# EAGLE design pads (EAGLE 9.4.2)
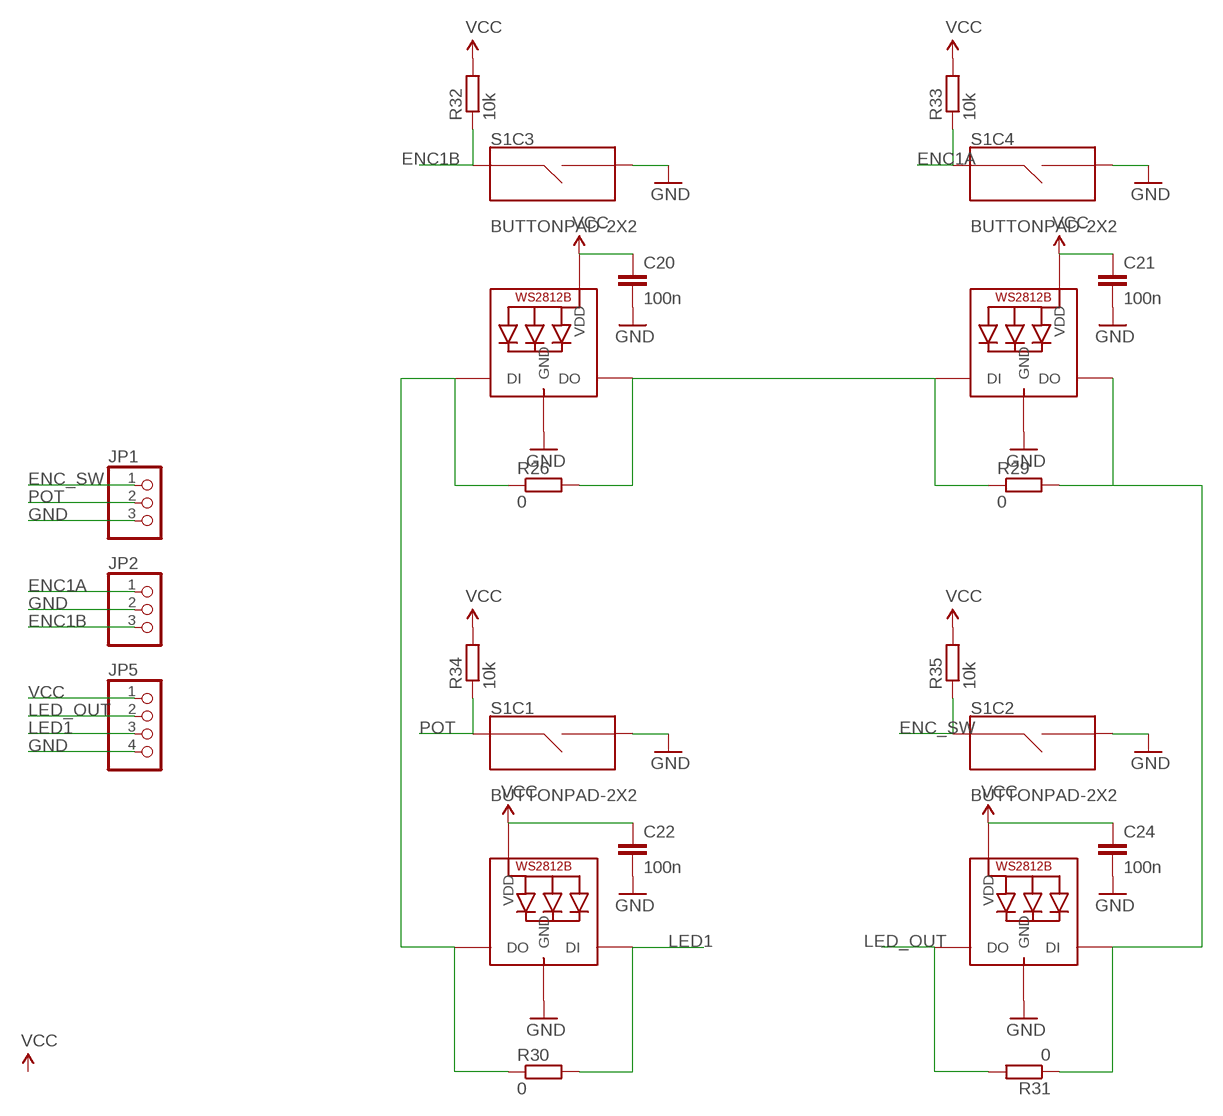
[diagram p0: schematic, sheet 1]

## Parts
C20  100n  CAP0603-CAP  [0603-CAP]
C21  100n  CAP0603-CAP  [0603-CAP]
C22  100n  CAP0603-CAP  [0603-CAP]
C24  100n  CAP0603-CAP  [0603-CAP]
JP1  PINHD-1X31X03_SMT  [1X03_SMT]
JP2  PINHD-1X31X03_SMT  [1X03_SMT]
JP5  PINHD-1X41X04_SMT  [1X04_SMT]
LED16  WS2812B3535  [LED3535]
LED17  WS2812B3535  [LED3535]
LED18  WS2812B3535  [LED3535]
LED19  WS2812B3535  [LED3535]
R26  0  R-EU_R0603  [R0603]
R29  0  R-EU_R0603  [R0603]
R30  0  R-EU_R0603  [R0603]
R31  0  R-EU_R0603  [R0603]
R32  10k  R-EU_R0603  [R0603]
R33  10k  R-EU_R0603  [R0603]
R34  10k  R-EU_R0603  [R0603]
R35  10k  R-EU_R0603  [R0603]
S1  BUTTONPAD-2X2  [BUTTONPAD-2X2-SINGLE]

## Nets
ENC1A: JP2.1 R33.1 S1.SIG7(C4:SIG1)
ENC1B: JP2.3 R32.1 S1.SIG5(C3:SIG1)
ENC_SW: JP1.1 R35.1 S1.SIG3(C2:SIG1)
GND: C20.2 C21.2 C22.2 C24.2 JP1.3 JP2.2 JP5.4 LED16.4(GND) LED17.4(GND) LED18.4(GND) LED19.4(GND) S1.SIG2(C1:SIG2) S1.SIG4(C2:SIG2) S1.SIG6(C3:SIG2) S1.SIG8(C4:SIG2)
LED1: JP5.3 LED16.1(DI) R30.2
LED_OUT: JP5.2 LED17.3(DO) R31.2
N$13: LED16.3(DO) LED18.1(DI) R26.1 R30.1
N$43: LED17.1(DI) LED19.3(DO) R29.2 R31.1
N$44: LED18.3(DO) LED19.1(DI) R26.2 R29.1
POT: JP1.2 R34.1 S1.SIG1(C1:SIG1)
VCC: C20.1 C21.1 C22.1 C24.1 JP5.1 LED16.2(VDD) LED17.2(VDD) LED18.2(VDD) LED19.2(VDD) R32.2 R33.2 R34.2 R35.2

## Library data of the parts
C20-C22 C24 = SparkFun-Capacitors:CAP: Capacitor Standard 0603 ceramic capacitor, and 0.1" leaded capacitor.
JP1 JP2 = pinhead_plus:PINHD-1X3: PIN HEADER
JP5 = pinhead_plus:PINHD-1X4: PIN HEADER
LED16-LED19 = i2c_encoder:WS2812B
R26 R29-R35 = rcl:R-EU_: RESISTOR, European symbol
S1 = i2c_encoder:BUTTONPAD-2X2: 2x2 Button Pad w/ Single LEDs Layout and schematic for 2x2 button pad with single-color LEDs under each button. For use with the Button Pad 2x2 - LED Compatible <https://www.sparkfun.com/products/7836> and Button Pad 2x2 Top Bezel <https://www.sparkfun.com/products/8746>. Any single-color 5mm LED <https://www.sparkfun.com/categories/172> should be compatible. SparkFun Products SparkFun Simon Says - Through-Hole Soldering Kit <https://www.sparkfun.com/products/10547> (KIT-10547) Button Pad 2x2 - Breakout PCB <https://www.sparkfun.com/products/9277> (COM-09277); PROD_ID: COMP-08481; SF_SKU: COM-07836

## Board
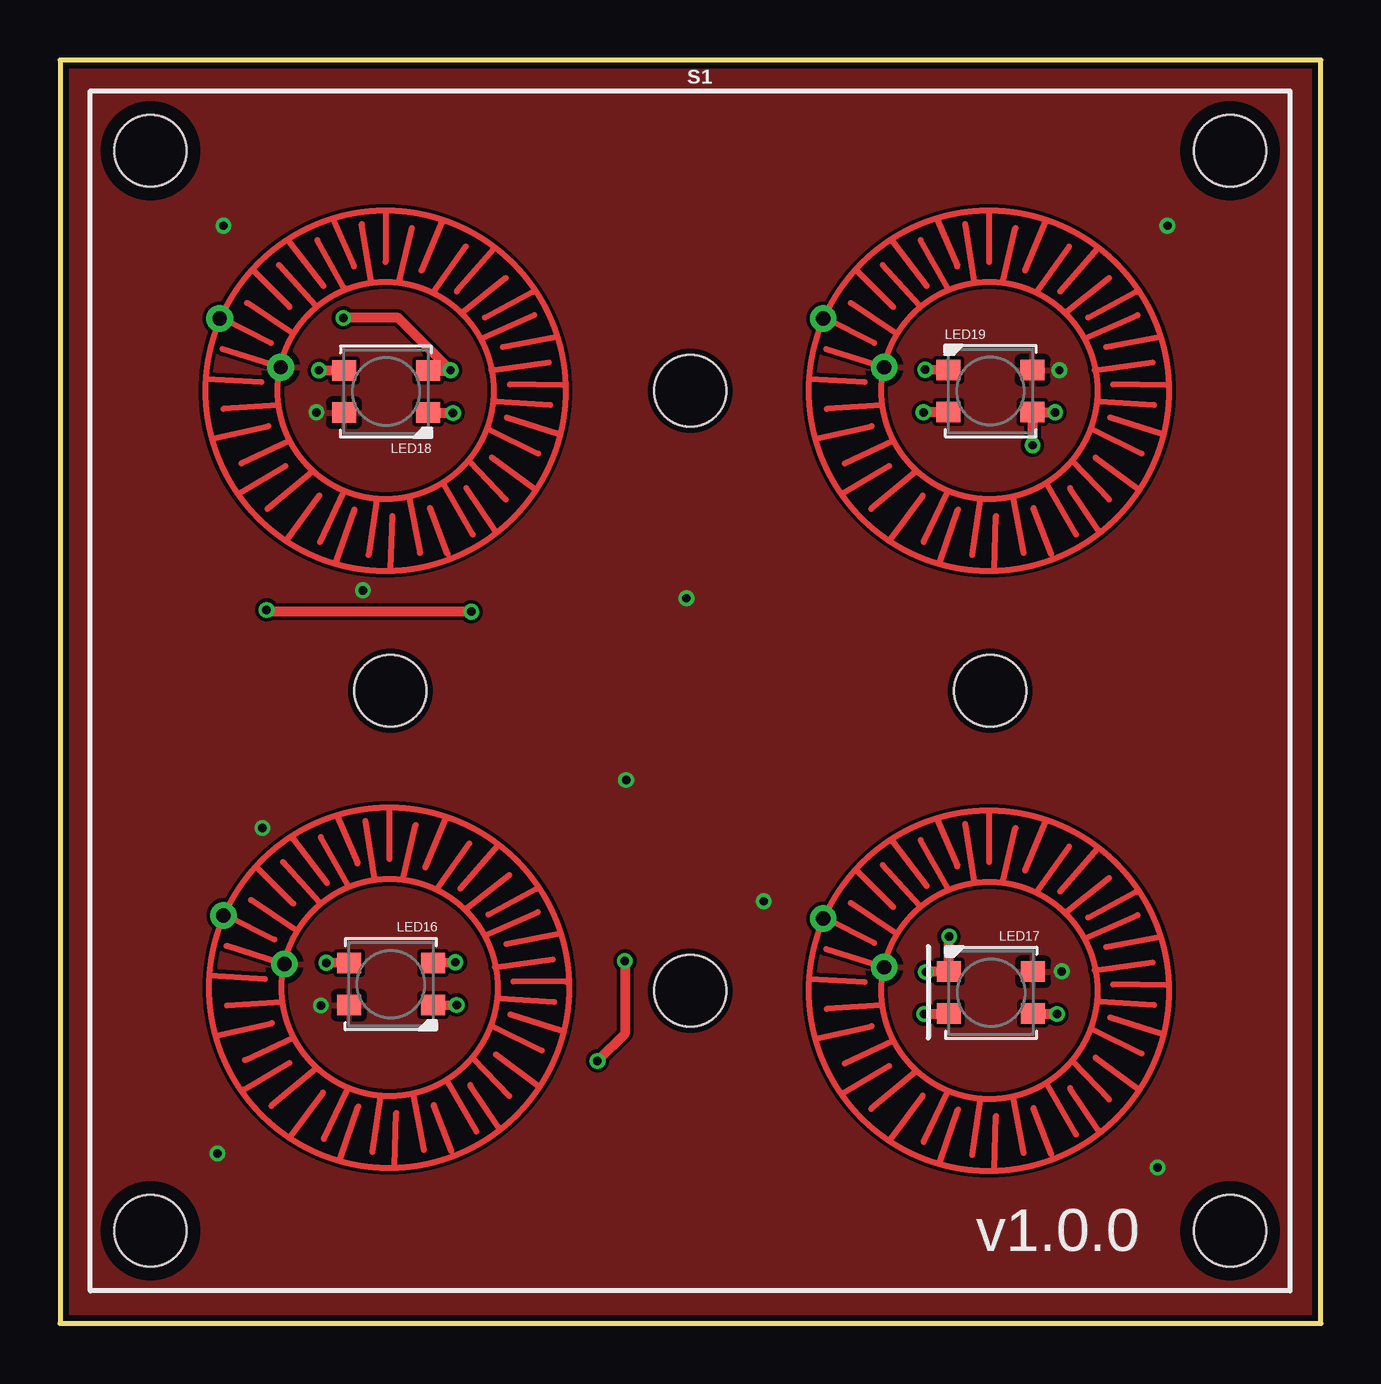
[diagram p1: board, top side]
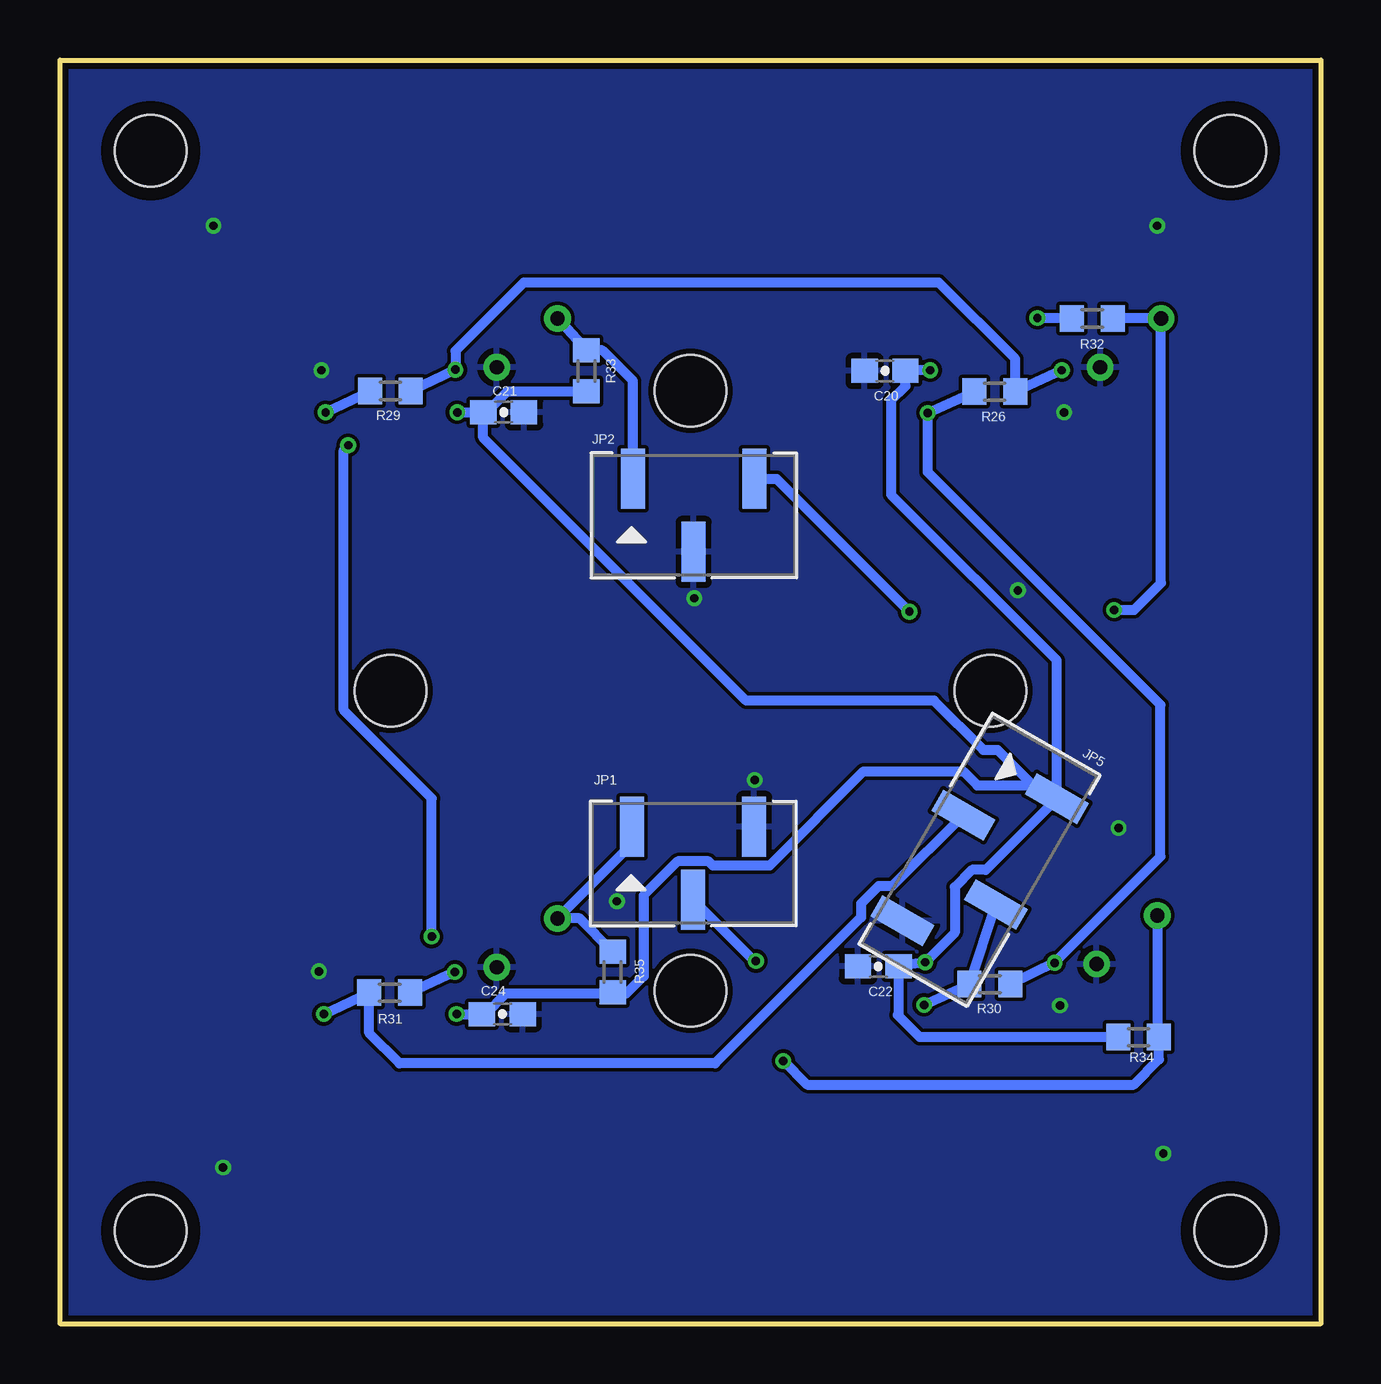
[diagram p2: board, bottom side, seen from below]

Size 52.55 x 52.65 mm. Coordinates in mm from the lower left corner, seen from the top.
Outline: 52.55,0 52.55,52.65 0,52.65 0,0 52.55,0
Copper layers (1*16): Top 0.035mm / dielectric 1.5mm / Bottom 0.035mm
Design rules "SeeedStudio_2layer_DRU_no_angle_20140221": minimum track width 6mil, minimum drill 12mil, track to track 6mil, track to pad 6mil, pad to pad 6mil, via to via 6mil, smd to smd 0mil, copper to edge 10mil, drill to drill 10mil, minimum pad ring 10mil, minimum via ring 6mil, stop-mask expansion 2mil, vias tented up to drill 100mil, thermal gap 10mil

### Footprints (pad centres in the part's own frame; a part is rotated, then mirrored left to right if it is on the bottom)
0603-CAP = smd 1.1 x 1: 1 -0.85,0; 2 0.85,0
1X03_SMT = smd 1 x 2.5: 1 -2.54,1.52; 2 0,-1.52; 3 2.54,1.52
1X04_SMT = smd 1 x 2.5: 1 -3.81,1.52; 2 -1.27,-1.52; 3 1.27,1.52; 4 3.81,-1.52
LED3535 = smd 1 x 0.85: 1 -1.75,0.875; 2 -1.75,-0.875; 3 1.75,-0.875; 4 1.75,0.875
R0603 = smd 1 x 1.1: 1 -0.85,0; 2 0.85,0
BUTTONPAD-2X2-SINGLE = drill 0.6: SIG1 5.542,15.64; SIG2 8.082,13.608; SIG3 30.542,15.513; SIG4 33.082,13.481; SIG5 5.388,40.513; SIG6 7.928,38.481; SIG7 30.542,40.513; SIG8 33.082,38.481 | hole 3: 12.5,25; 25,37.5; 37.5,25; 25,12.5; 2.5,2.5; 2.5,47.5; 47.5,47.5; 47.5,2.5

### Placement (x,y rotation side)
C20  18.16,39.7 180 bottom
C21  34.06,37.97 0 bottom
C22  18.44,14.88 180 bottom
C24  34.11,12.9 0 bottom
JP1  26.16,19.18 0 bottom
JP2  26.14,33.68 0 bottom
JP5  14.22,19.33 240 bottom
LED16  13.79,14.15 180 top
LED17  38.81,13.79 0 top
LED18  13.59,38.84 180 top
LED19  38.79,38.86 0 top
R26  13.59,38.84 0 bottom
R29  38.79,38.86 180 bottom
R30  13.79,14.15 180 bottom
R31  38.81,13.79 180 bottom
R32  9.53,41.88 180 bottom
R33  30.61,39.7 270 bottom
R34  7.59,11.94 180 bottom
R35  29.51,14.66 270 bottom
S1  1.27,1.37 0 top

### Tracks (layer width: path | path; a pad name or v marks a point on that pad's centre or on a via)
ENC1A
  Bottom 0.406: S1.SIG7 R33.1 29.95,40.55 28.68,39.28 JP2.1
ENC1B  (via drill 0.35)
  Top 0.406: v17.14,29.67 8.69,29.67 v8.61,29.74
  Bottom 0.406: R32.1 S1.SIG5 6.66,30.86 7.77,29.74 v8.61,29.74 | JP2.3 22.68,35.2 v17.14,29.67
ENC_SW
  Bottom 0.406: R35.1 30.89,16.88 S1.SIG3 28.7,19.99 JP1.1
GND  (via drill 0.35)
  other vias: 46.16,45.75 6.82,45.75 6.56,7.09 45.75,6.5 29.34,17.6 41.76,14.68 10.87,13.26 10.69,37.97 41.66,39.73 26.11,30.23 23.6,22.66 8.43,20.65 12.62,30.56
  pour Top: -2.11,57.3 55.19,57.3 55.19,-3.4 -2.11,-3.4 -2.11,57.28
  pour Bottom: -2.11,57.3 55.19,57.3 55.19,-3.4 -2.11,-3.4 -2.11,57.28
LED1  (via drill 0.35)
  Top 0.406: LED16.1 v16.54,13.28
  Bottom 0.406: JP5.3 13.3,17.23 | JP5.3 13.49,17.47 | v16.54,13.28 R30.2 JP5.3
LED_OUT  (via drill 0.35)
  Top 0.406: LED17.3 v41.54,12.92 v41.55,12.9
  Bottom 0.406: v41.55,12.9 R31.2 39.66,12.1 38.41,10.85 25.25,10.85 19.16,16.94 19.16,17.51 18.44,18.23 17.86,18.23 JP5.2
N$13  (via drill 0.35)
  Top 0.406: LED16.3 v11.1,15.04 | LED18.1 16.37,37.96 v16.38,37.95
  Bottom 0.406: R30.1 v11.1,15.04 6.68,19.46 6.68,25.78 16.38,35.48 v16.38,37.95 R26.1
N$43  (via drill 0.35)
  Top 0.406: v37.06,16.13 LED17.1 v36.09,14.66 | v40.54,36.6 LED19.3 v41.48,37.97
  Bottom 0.406: v37.06,16.13 37.06,21.89 40.73,25.56 40.73,36.4 v40.54,36.59 v40.54,36.6 | v41.48,37.97 R29.2 | v36.09,14.66 R31.1
N$44  (via drill 0.35)
  Top 0.406: LED19.1 v36.07,39.75 | LED18.3 10.81,39.71 v10.79,39.73
  Bottom 0.406: R29.1 v36.07,39.75 36.07,40.54 33.22,43.38 15.93,43.38 12.74,40.2 R26.2 v10.79,39.73
POT  (via drill 0.35)
  Top 0.406: v23.55,15.11 23.55,12.09 v22.4,10.95
  Bottom 0.406: 25.91,17.66 JP1.2 23.62,15.11 v23.55,15.11 | 6.78,16.98 S1.SIG1 6.81,12.01 R34.1 6.75,11.01 7.8,9.96 21.41,9.96 v22.4,10.95 | 6.77,16.99 6.78,16.98 | 6.83,16.93 6.78,16.98
VCC  (via drill 0.35)
  Top 0.406: LED16.2 v16.48,15.06 | LED17.2 37.04,12.89 v36.02,12.9 | LED19.2 v35.99,37.97 | LED18.2 16.27,39.71 v16.28,39.73 14.1,41.91 v11.81,41.91
  Bottom 0.406: C22.1 v16.48,15.06 15.26,16.29 15.26,18.19 14.53,18.91 13.96,18.91 JP5.1 | v36.02,12.9 C24.1 34.81,12.9 33.96,13.76 29.56,13.76 | v35.99,37.97 C21.1 | 29.56,13.76 R35.2 | C22.1 17.74,14.88 | JP5.1 11.56,22.43 14.32,22.43 14.9,23.01 19.06,23.01 22.98,19.09 25.34,19.09 25.52,19.26 26.81,19.26 28.23,17.84 28.23,14.47 28.94,13.76 29.56,13.76 | JP5.1 11.43,21.87 13.47,23.91 14.07,23.91 16.12,25.96 23.95,25.96 34.91,36.92 C21.1 | JP5.1 10.39,21.26 | v16.28,39.73 17.29,39.73 C20.1 17.31,39.07 17.91,38.47 17.91,34.54 11,27.64 JP5.1 | C21.1 34.76,37.97 33.91,38.83 30.63,38.83 R33.2 | v11.81,41.91 10.4,41.91 R32.2 | R34.2 16.71,11.94 17.63,12.85 17.59,12.89 C22.1

### Text on the board
tNames: v1.0.0
Document: the height of an SK6812 is 1.6mm where / as the height for a smd encoder is ~4.5mm | Siirrä X3 ylemmäs? | use WS2812B or SK6812 to save on gpio pins | (0.1 -0.03) | GPIO needed: / I2C: 2 / SPI: 4 (+ interrupt?) / encoder: 2 / leds: 1 / = 5 - 7(/8) | (-0.1 -0.03) | (c> 2 1.9) | 0.5mm FFC max current = 0.55A / http://www.axon-cable.com/publications/FFC-Flat-Cables.pdf | CUTOUT | CUTOUT | F+M headerit päällekkäin on noin 5.1mm? | kooderin korkeus 4+(5-7 kierteet)mm | (0.03 0.1)